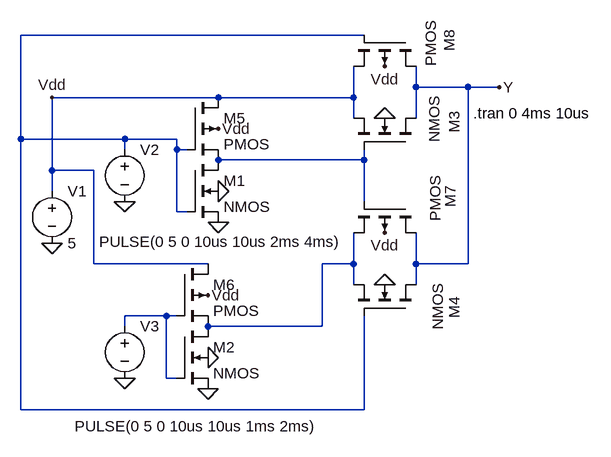
[diagram p0: schematic nand2tg.asc]
nand2tg.asc, the LTspice schematic file:
Version 4
SHEET 1 880 680
WIRE 432 -16 -96 -16
WIRE 512 64 512 32
WIRE 592 64 512 64
WIRE 640 64 592 64
WIRE 208 80 -48 80
WIRE 416 80 416 32
WIRE 416 80 208 80
WIRE 416 112 416 80
WIRE 512 112 512 64
WIRE -96 144 -96 -16
WIRE 64 144 -96 144
WIRE 144 144 64 144
WIRE 64 160 64 144
WIRE 144 160 144 144
WIRE 160 160 144 160
WIRE 432 176 432 160
WIRE 432 176 208 176
WIRE -48 192 -48 80
WIRE 16 192 -48 192
WIRE -48 224 -48 192
WIRE 432 240 432 176
WIRE 144 256 144 160
WIRE 160 256 144 256
WIRE 16 336 16 192
WIRE 192 336 16 336
WIRE 416 336 416 288
WIRE 416 336 368 336
WIRE 512 336 512 288
WIRE 592 336 592 64
WIRE 592 336 512 336
WIRE 416 368 416 336
WIRE 512 368 512 336
WIRE 128 416 64 416
WIRE 144 416 128 416
WIRE 64 432 64 416
WIRE 368 432 368 336
WIRE 368 432 192 432
WIRE 128 512 128 416
WIRE 144 512 128 512
WIRE -96 560 -96 144
WIRE 432 560 432 416
WIRE 432 560 -96 560
FLAG -48 80 Vdd
FLAG 464 32 Vdd
FLAG 464 288 Vdd
FLAG 208 128 Vdd
FLAG 192 384 Vdd
FLAG 464 368 0
FLAG 464 112 0
FLAG 208 224 0
FLAG 192 480 0
FLAG -48 304 0
FLAG 64 240 0
FLAG 64 512 0
FLAG 208 272 0
FLAG 192 528 0
FLAG 640 64 Y
SYMBOL nmos4 160 176 R0
SYMATTR InstName M1
SYMBOL nmos4 144 432 R0
SYMATTR InstName M2
SYMBOL nmos4 512 160 M270
WINDOW 0 25 -59 Left 2
WINDOW 3 11 -28 Left 2
SYMATTR InstName M3
SYMBOL nmos4 512 416 M270
WINDOW 0 -4 -59 Left 2
WINDOW 3 -22 -34 Left 2
SYMATTR InstName M4
SYMBOL pmos4 160 80 R0
SYMATTR InstName M5
SYMBOL pmos4 144 336 R0
SYMATTR InstName M6
SYMBOL pmos4 512 240 R90
WINDOW 0 -24 -53 Left 2
WINDOW 3 -40 -30 Left 2
SYMATTR InstName M7
SYMBOL pmos4 512 -16 R90
WINDOW 0 -8 -51 Left 2
WINDOW 3 -22 -23 Left 2
SYMATTR InstName M8
SYMBOL voltage -48 208 R0
WINDOW 123 0 0 Left 2
WINDOW 39 0 0 Left 2
SYMATTR InstName V1
SYMATTR Value 5
SYMBOL voltage 64 144 R0
WINDOW 3 -39 158 Left 2
WINDOW 123 0 0 Left 2
WINDOW 39 0 0 Left 2
SYMATTR Value PULSE(0 5 0 10us 10us 2ms 4ms)
SYMATTR InstName V2
SYMBOL voltage 64 416 R0
WINDOW 3 -77 170 Left 2
WINDOW 123 0 0 Left 2
WINDOW 39 0 0 Left 2
SYMATTR Value PULSE(0 5 0 10us 10us 1ms 2ms)
SYMATTR InstName V3
TEXT 600 104 Left 2 !.tran 0 4ms 10us

The netlist it stands for:
* nand2tg.asc
M1 N002 N001 0 0 NMOS
M2 N003 N004 0 0 NMOS
M3 Y N002 Vdd 0 NMOS
M4 Y N001 N003 0 NMOS
M5 Vdd N001 N002 Vdd PMOS
M6 Vdd N004 N003 Vdd PMOS
M7 Y N002 N003 Vdd PMOS
M8 Y N001 Vdd Vdd PMOS
V1 Vdd 0 5
V2 N001 0 PULSE(0 5 0 10us 10us 2ms 4ms)
V3 N004 0 PULSE(0 5 0 10us 10us 1ms 2ms)
.model NMOS NMOS
.model PMOS PMOS
.lib standard.mos
.tran 0 4ms 10us
.backanno
.end